# Altium schematic sheet ADC.SchDoc
size A; SheetNumber: 3; SheetTotal: 7
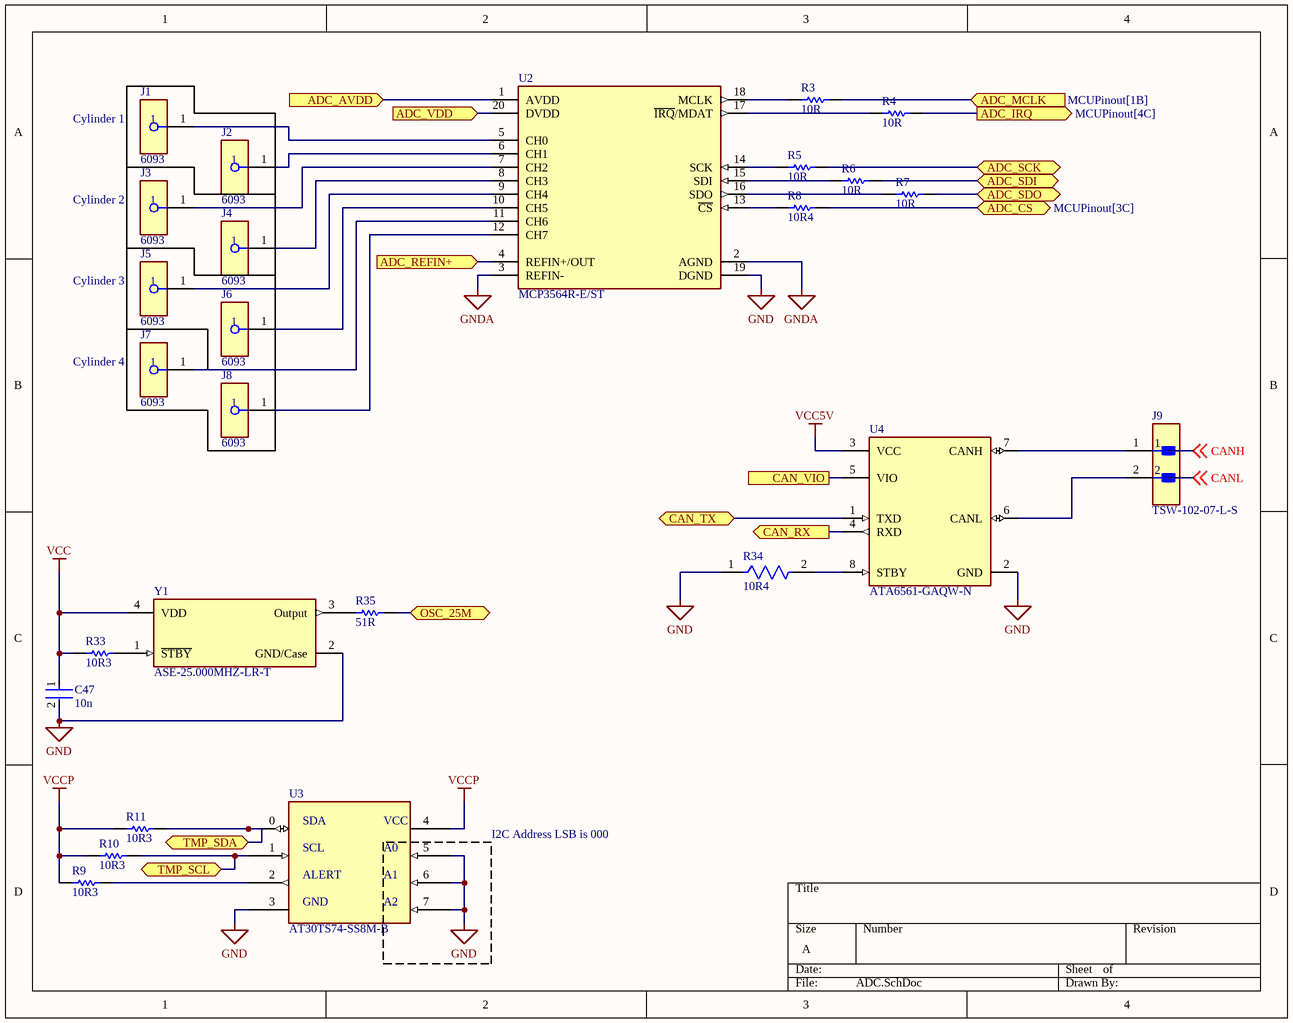
[diagram p0: ADC.SchDoc]

## Parts
C47  10n  [FP-GRM033-0_03-MFG]
J1  6093  [FP-6093-MFG]
J2  6093  [FP-6093-MFG]
J3  6093  [FP-6093-MFG]
J4  6093  [FP-6093-MFG]
J5  6093  [FP-6093-MFG]
J6  6093  [FP-6093-MFG]
J7  6093  [FP-6093-MFG]
J8  6093  [FP-6093-MFG]
J9  TSW-102-07-L-S  [FP-TSW-102-07-L-S-MFG]
R3  10R  [RESC2013X60X35ML10T20]
R4  10R  [RESC2013X60X35ML10T20]
R5  10R  [RESC2013X60X35ML10T20]
R6  10R  [RESC2013X60X35ML10T20]
R7  10R  [RESC2013X60X35ML10T20]
R8  10R4  [RESC2013X60X35ML10T20]
R9  10R3  [RESC3116X65X40ML10T20]
R10  10R3  [RESC3116X65X40ML10T20]
R11  10R3  [RESC3116X65X40ML10T20]
R33  10R3  [RESC3116X65X40ML10T20]
R34  10R4  [FP-RC0603-0_55-IPC_C]
R35  51R  [RESC3116X65X40ML10T20]
U2  MCP3564R-E/ST  [FP-C04-088-MFG]
U3  AT30TS74-SS8M-B  [MCHP-SN8_V]
U4  ATA6561-GAQW-N  [FP-C04-057-OA-MFG]
Y1  ASE-25.000MHZ-LR-T  [FP-ASE-MFG]

## Ports
ADC_AVDD (in, see 3.3V[1C]), ADC_CS (bidir, see MCUPinout[3C]), ADC_IRQ (out, see MCUPinout[4C]), ADC_MCLK (in, see MCUPinout[1B]), ADC_REFIN+ (in, see 3.3V[1C]), ADC_SCK (bidir, see MCUPinout[1B]), ADC_SDI (bidir, see MCUPinout[4B]), ADC_SDO (bidir, see MCUPinout[1B]), ADC_VDD (in, see 3.3V[2C]), CAN_RX (out, see MCUPinout[4B]), CAN_TX (bidir, see MCUPinout[4B]), CAN_VIO (see 3.3V[1D]), OSC_25M (bidir, see ETH[3B]), TMP_SCL (bidir, see MCUPinout[4C]), TMP_SDA (bidir, see MCUPinout[4C])

## Nets
GND: C47.2 R34.1 U2.19(DGND) U3.3 U3.5 U3.6 U3.7 U4.2(GND) Y1.2(GND/Case)
GNDA: U2.2(AGND) U2.3(REFIN-)
VCC: C47.1 R33.1 Y1.4(VDD)
VCC5V: U4.3(VCC)
VCCP: R9.1 R10.1 R11.1 U3.4
ADC_AVDD: U2.1(AVDD) ; port ADC_AVDD
ADC_CS: R8.2 ; port ADC_CS
ADC_IRQ: R4.2 ; port ADC_IRQ
ADC_MCLK: R3.2 ; port ADC_MCLK
ADC_REFIN+: U2.4(REFIN+/OUT) ; port ADC_REFIN+
ADC_SCK: R5.2 ; port ADC_SCK
ADC_SDI: R6.2 ; port ADC_SDI
ADC_SDO: R7.2 ; port ADC_SDO
ADC_VDD: U2.20(DVDD) ; port ADC_VDD
CAN_RX: U4.4(RXD) ; port CAN_RX
CAN_TX: U4.1(TXD) ; port CAN_TX
CAN_VIO: U4.5(VIO) ; port CAN_VIO
OSC_25M: R35.2 ; port OSC_25M
TMP_SCL: R10.2 U3.1 ; port TMP_SCL
TMP_SDA: R11.2 U3.0 ; port TMP_SDA
NetJ1_1: J1.1 U2.5(CH0)
NetJ2_1: J2.1 U2.6(CH1)
NetJ3_1: J3.1 U2.7(CH2)
NetJ4_1: J4.1 U2.8(CH3)
NetJ5_1: J5.1 U2.9(CH4)
NetJ6_1: J6.1 U2.10(CH5)
NetJ7_1: J7.1 U2.11(CH6)
NetJ8_1: J8.1 U2.12(CH7)
NetJ9_1: J9.1 U4.7(CANH)
NetJ9_2: J9.2 U4.6(CANL)
NetR3_1: R3.1 U2.18(MCLK)
NetR4_1: R4.1 U2.17(~{IRQ}/MDAT)
NetR5_1: R5.1 U2.14(SCK)
NetR6_1: R6.1 U2.15(SDI)
NetR7_1: R7.1 U2.16(SDO)
NetR8_1: R8.1 U2.13(~{CS})
NetR9_2: R9.2 U3.2
NetR33_2: R33.2 Y1.1(~{STBY})
NetR34_2: R34.2 U4.8(STBY)
NetR35_1: R35.1 Y1.3(Output)

## Notes on the sheet
- (near J1) Cylinder 1
- (near J3) Cylinder 2
- (near J5) Cylinder 3
- (near J7) Cylinder 4
- I2C Address LSB is 000
- (in symbol AT30TS74_0217) SDA; VCC; SCL; A0; ALERT; A1; GND; A2

## Library data of the parts
C47 = CMP-06035-000062-2: Chip Multilayer Ceramic Capacitors for General Purpose, 0201, 0.10uF, X5R, 15%, 10%, 6.3V; Capacitance: 100nF; Min Operating Temperature: -55°C; Lead Free: Lead Free; Radiation Hardening: No; Dielectric: X5R; Voltage Rating (DC): 6.3V; REACH SVHC: No SVHC; Case/Package: 0201; Voltage Rating: 6.3V; Length: 0.6mm; Max Operating Temperature: 85°C; Width: 0.012inch; Depth: 0.3mm; Material: Ceramic; Case Code (Metric): 0603; Thickness: 0.013inch; Packaging: Tape and Reel; Height: 0.3mm; Weight: 6E-06oz; Package Quantity: 1; Mount: Surface Mount; Voltage: 6.3V; Case Code (Imperial): 0201; Tolerance: 10%; Termination: SMD/SMT
J1-J8 = CMP-19636-000026-1: CONN BANANA JACK SOLDER LUG RED; Gender: Female; Pitch: 0.375inch; Number of Contacts: 3; Insulation: Mating End Insulated; Body Material: Brass; Hole Diameter: 0.12inch; Material: Paper; Contact Material: Brass; Number of Rows: 1; Contact Plating: Tin; Series: -; RoHS Compliant: No; Insulation Material: Nylon; Orientation: Straight; Package Quantity: 1; REACH SVHC: No SVHC; Termination: Solder; Number of Positions: 3; Color: Red; Mount: Panel; Lead Free: Lead Free; Packaging: Bulk
J9 = CMP-02766-001428-1: CONN HEADER VERT 2POS 2.54MM; Voltage Rating: 550V; Current Rating: 7.6A; Gender: Male; Number of Contacts: 2; Connector Type: Male Pin; Radiation Hardening: No; Orientation: Straight; Contact Plating: Gold; Max Operating Temperature: 125°C; Mount: Through Hole; Package Quantity: 1; Number of Rows: 1; Housing Material: Polyester; RoHS Compliant: Yes; Length: 5.08mm; Max Voltage Rating (AC): 550V; Pitch: 2.54mm; Packaging: Bulk; Depth: 2.54mm; Termination: Solder; Min Operating Temperature: -55°C; Housing Color: Black; Lead Free: Lead Free; Color: Black; Number of Positions: 2; Width: 2.54mm; Max Current Rating: 7.6A; REACH SVHC: No SVHC; Contact Material: Bronze; Contact Mating Length: 0.23inch; Series: TSW; Contact Type: Male Pin
R3-R8 = CMP-2100-03670-1: Chip Resistor, 10 Ohm, +/- 1%, 0.125 W, -55 to 155 degC, 0805 (2012 Metric), RoHS, Tape and Reel; Manufacturer: Yageo; Resistance: 10Ohm; Power Rating: 125mW; Voltage Rating: 150V; Temperature Coefficient: 200ppm/degreesC; Number of Pins: 2; REACH SVHC: NoSVHC; Datasheet Version: Rev. 5, 10/2016; Max Operating Temperature: 155degC; Manufacturer URL: http://www.yageo.com/; Case Code (Imperial): 0805; Package Description: 2-Pin Surface Mounted Device, Body 2 x 1.25 mm; Case Code (Metric): 2012; Length: 2mm; RoHSCompliant: true; Max Power Dissipation: 125mW; Depth: 1.25mm; Packaging: TapeandReel; Height: 0.5mm; Package Reference: 0805; Package Quantity: 1; Tolerance: 1%; Termination: SMD/SMT; Min Operating Temperature: -55degC; Lead Free: LeadFree; Width: 1.25mm; Voltage Rating (DC): 150V; Datasheet URL: http://www.yageo.com/NewPortal/yageodocoutput?fileName=/pdf/R-Chip/PYu-RC_Group_51_RoHS_L_5.pdf; Composition: ThickFilm; Number of Terminations: 2; Case/Package: 0805
R9-R11 R33 R35 = CMP-2100-03678-1: Chip Resistor, 1 KOhm, +/- 1%, 0.25 W, -55 to 155 degC, 1206 (3216 Metric), RoHS, Tape and Reel; Manufacturer: Yageo; Temperature Coefficient: 100ppm/degreesC; Power Rating: 250mW; Voltage Rating: 200V; Resistance: 1KOhm; Composition: ThickFilm; Min Operating Temperature: -55degC; Tolerance: 1%; REACH SVHC: Unknown; Case Code (Metric): 3216; Military Standard: Not; Datasheet Version: Rev. 5, 10/2016; Package Reference: 1206.0; Case/Package: 1206; Length: 3.1mm; Manufacturer URL: http://www.yageo.com/; Lead Free: LeadFree; RoHSCompliant: true; Termination: SMD/SMT; Packaging: TapeandReel; Package Description: 2-Pin Surface Mount Device, Body 3.1 x 1.6 mm; Depth: 1.6mm; Case Code (Imperial): 1206; Max Operating Temperature: 155degC; Datasheet URL: http://www.yageo.com/NewPortal/yageodocoutput?fileName=/pdf/R-Chip/PYu-RC_Group_51_RoHS_L_5.pdf; Height: 0.55mm
R34 = CMP-2100-03664-2: RES 10K OHM 1% 1/10W 0603; Voltage Rating: 75V; Voltage Rating (DC): 50V; Resistance: 10kR; Power Rating: 100mW; Temperature Coefficient: 100ppm/°C; Depth: 0.8mm; Termination: SMD/SMT; Resistor Type: Thick Film; Series: RC; Construction: Rectangular; Features: Moisture Resistant; Packaging: Tape and Reel; Min Operating Temperature: -55°C; Number of Terminations: 2; Lead Pitch: 0.3mm; RoHS Compliant: Yes; Case/Package: 0603; Resistance Tolerance: 1%; Military Standard: Not; Weight: 7.1E-05oz; Number of Pins: 2; Tolerance: 1%; Length: 1.6mm; Case Code (Imperial): 0603; Lead Free: Lead Free; Width: 0.8mm; Max Power Dissipation: 100mW; Height: 0.45mm; Max Operating Temperature: 155°C; Case Code (Metric): 1608; Size Code: 0603
U2 = CMP-00252-111742343-1: MCP3564R-E/ST 8-Channel Single ADC Delta-Sigma 153.6ksps 24-bit Serial 20-Pin TSSOP Tube; Interface: SPI; Max Junction Temperature (Tj): 150°C; Min Supply Voltage: 1.8V; Number of Channels: 8; Max Supply Voltage: 3.6V; Number of Converters: 1; Max Operating Temperature: 125°C; Lifecycle Status: Production; Height: 1.2mm; Ambient Temperature Range High: 125°C; NexarPartId: 111742343; Sampling Rate: 153.6ksps; Min Operating Temperature: -40°C
U3 = AT30TS74_0217: Temp Sensor Digital Serial (2-Wire, I2C, SMBus) 8-Pin SOIC Tube; pin to pad: 0>1 1>2 2>3 3>4 4>5 5>6 6>7 7>8; Manufacturer: Microchip; Package Shape/Style: Rectangular; Accuracy-Max (Cel): 3°C; Number of Bits: 12; Operating Current-Max: 800uA; Sensor Type: TEMPERATURE SENSOR,SWITCH/DIGITAL OUTPUT,SERIAL; Max Supply Voltage: 5.5V; Min Supply Voltage: 1.7V; Body Breadth: 3.9inch; Body Height: 1.75mm; Body Length or Diameter: 4.9mm; Supplier: Mouser; Supplier Part Number: 556-AT30TS74-SS8M-B; Manufacturer Part Number: AT30TS74-SS8M-B; Category: Uncategorized; Stock: 7962; Pricing: 1=0.82, 10=0.82, 50=0.68, 100=0.662, 1000=0.662, 10000=0.654 (USD); Mounting Technology: Surface Mount; Housing Material: Plastic; Min Operating Temperature: -40°C; Max Operating Temperature: 125°C; Output Interface Type: 2-Wire; Termination: Solder; Reach SVHC Compliant: Yes; ComponentLink1URL: https://datasheet.ciiva.com:443/pdfs/VipMasterIC/IC/ATML/ATML-S-A0001248569/ATML-S-A0001248569-1.pdf?src-supplier=IHS+Markit; ComponentLink1Description: https://datasheet.ciiva.com:443/pdfs/VipMasterIC/IC/ATML/ATML-S-A0001248569/ATML-S-A0001248569-1.pdf?src-supplier=IHS+Markit; ComponentLink2URL: http://www.microchip.com/mymicrochip/filehandler.aspx?ddocname=en590216&src-supplier=Digikey; ComponentLink2Description: http://www.microchip.com/mymicrochip/filehandler.aspx?ddocname=en590216&src-supplier=Digikey; ComponentLink3URL: http://www.atmel.com/Images/Atmel-8897-DTS-AT30TS74-Datasheet.pdf?src-supplier=Avnet; ComponentLink3Description: http://www.atmel.com/Images/Atmel-8897-DTS-AT30TS74-Datasheet.pdf?src-supplier=Avnet; ComponentLink4URL: https://datasheet.octopart.com/AT30TS74-SS8M-B-Microchip-datasheet-140384934.pdf?src-supplier=microchipDIRECT; ComponentLink4Description: https://datasheet.octopart.com/AT30TS74-SS8M-B-Microchip-datasheet-140384934.pdf?src-supplier=microchipDIRECT
U4 = CMP-06279-000002-1: IC TRANSCEIVER 1/1 8SO; Manufacturer: Microchip Technology; Min Supply Voltage: 2.8V; Standoff Height: 0.1mm; Nominal Supply Current: 50mA; Interface: CAN; Max Junction Temp: +150°C; Max Supply Voltage: 5.5V; Digikey Description: IC TRANSCEIVER 1/1 8SO; Footprint Url: http://ww1.microchip.com/downloads/en/DeviceDoc/08L_SOIC_150_3dot9mm_OA_C04-00057e.pdf; ComponentLink2Description: Datasheet; Category: IC; Lead Free: Yes; Package: C04-057-OA; Manufacturer Part Number: ATA6561-GAQW-N; Height: 1.75mm; ComponentLink2URL: http://ww1.microchip.com/downloads/en/DeviceDoc/ATA6560-ATA6561-High-Speed-CAN-Transceiver-DS20005991A.pdf; Mouser Description: CAN - Controller Area Network 5Mbps Unpowered/Standby/Normal 4.5V to 5.5V 8-Pin SOIC T/R; Device Class L1: Integrated Circuits (ICs); Device Class L3: unset; Automotive: No; Temperature Range High: +150°C; Temperature: -40°C to +150°C; RoHS: TRUE; Device Class L2: Interface ICs; Temperature Range Low: -40°C; Octopart: https://octopart.com/ata6561-gaqw-n-microchip-93294113; Ipc Land Pattern Name: SOIC127P600X155-8
Y1 = CMP-27762-000357-1: XTAL Oscillator 25MHz ±25ppm CMOS 3.3V 4-SMD 3.2mm x 2.5mm; Min Supply Voltage: 3.135V; Max Supply Current: 13mA; Max Supply Voltage: 3.465V; Load Capacitance: 15pF; Height: 0.047inch; Series: ASE; Frequency Stability: 25ppm; Mount: Surface Mount; Case/Package: SMD/SMT; Width: 0.098inch; Operating Frequency: 25 MHz; REACH SVHC: No SVHC; Package Quantity: 1000; Number of Pins: 4; Termination: SMD/SMT; Frequency: 25MHz; Max Operating Temperature: 85°C; Packaging: Tape and Reel; Min Operating Temperature: -40°C; Lead Free: Lead Free; Length: 0.126inch; Operating Supply Voltage: 3.3V